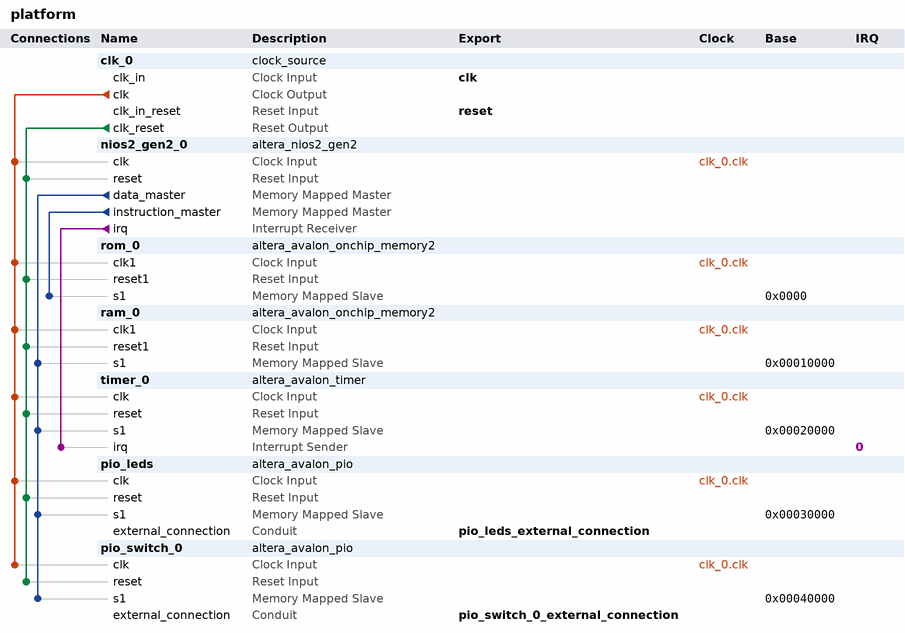
[diagram p0: system contents]
# Platform Designer (Qsys) system platform, Cyclone V 5CSEMA5F31C6
# Parameters at their usual value, and those the tool derives, are not listed.
package require -exact qsys 20.1
create_system platform
set_project_property DEVICE_FAMILY {Cyclone V}
set_project_property DEVICE 5CSEMA5F31C6

add_instance clk_0 clock_source 20.1
set_instance_parameter_value clk_0 clockFrequency 50000000

add_instance nios2_gen2_0 altera_nios2_gen2 20.1
set_instance_parameter_value nios2_gen2_0 dcache_size 2048
set_instance_parameter_value nios2_gen2_0 debug_enabled false
set_instance_parameter_value nios2_gen2_0 exceptionSlave rom_0.s1
set_instance_parameter_value nios2_gen2_0 icache_size 4096
set_instance_parameter_value nios2_gen2_0 impl Tiny
set_instance_parameter_value nios2_gen2_0 resetSlave rom_0.s1

add_instance rom_0 altera_avalon_onchip_memory2 20.1
set_instance_parameter_value rom_0 dataWidth 32
set_instance_parameter_value rom_0 dualPort false
set_instance_parameter_value rom_0 initMemContent true
set_instance_parameter_value rom_0 initializationFileName onchip_mem.hex
set_instance_parameter_value rom_0 memorySize 4096
set_instance_parameter_value rom_0 writable false

add_instance ram_0 altera_avalon_onchip_memory2 20.1
set_instance_parameter_value ram_0 dataWidth 32
set_instance_parameter_value ram_0 dualPort false
set_instance_parameter_value ram_0 initMemContent true
set_instance_parameter_value ram_0 initializationFileName onchip_mem.hex
set_instance_parameter_value ram_0 memorySize 16384

add_instance timer_0 altera_avalon_timer 20.1
set_instance_parameter_value timer_0 alwaysRun true
set_instance_parameter_value timer_0 fixedPeriod true
set_instance_parameter_value timer_0 period 1
set_instance_parameter_value timer_0 periodUnits SEC
set_instance_parameter_value timer_0 snapshot false

add_instance pio_leds altera_avalon_pio 20.1
set_instance_parameter_value pio_leds direction Output
set_instance_parameter_value pio_leds width 10

add_instance pio_switch_0 altera_avalon_pio 20.1
set_instance_parameter_value pio_switch_0 direction Input
set_instance_parameter_value pio_switch_0 width 1

# connections
add_connection clk_0.clk nios2_gen2_0.clk clock
add_connection clk_0.clk pio_leds.clk clock
add_connection clk_0.clk pio_switch_0.clk clock
add_connection clk_0.clk ram_0.clk1 clock
add_connection clk_0.clk rom_0.clk1 clock
add_connection clk_0.clk timer_0.clk clock
add_connection clk_0.clk_reset nios2_gen2_0.reset reset
add_connection clk_0.clk_reset pio_leds.reset reset
add_connection clk_0.clk_reset pio_switch_0.reset reset
add_connection clk_0.clk_reset ram_0.reset1 reset
add_connection clk_0.clk_reset rom_0.reset1 reset
add_connection clk_0.clk_reset timer_0.reset reset
add_connection nios2_gen2_0.data_master pio_leds.s1 avalon
set_connection_parameter_value nios2_gen2_0.data_master/pio_leds.s1 baseAddress 0x00030000
add_connection nios2_gen2_0.data_master pio_switch_0.s1 avalon
set_connection_parameter_value nios2_gen2_0.data_master/pio_switch_0.s1 baseAddress 0x00040000
add_connection nios2_gen2_0.data_master ram_0.s1 avalon
set_connection_parameter_value nios2_gen2_0.data_master/ram_0.s1 baseAddress 0x00010000
add_connection nios2_gen2_0.data_master timer_0.s1 avalon
set_connection_parameter_value nios2_gen2_0.data_master/timer_0.s1 baseAddress 0x00020000
add_connection nios2_gen2_0.instruction_master rom_0.s1 avalon
set_connection_parameter_value nios2_gen2_0.instruction_master/rom_0.s1 baseAddress 0x0000
add_connection nios2_gen2_0.irq timer_0.irq interrupt
set_connection_parameter_value nios2_gen2_0.irq/timer_0.irq irqNumber 0

# exported interfaces
add_interface clk clock sink
set_interface_property clk EXPORT_OF clk_0.clk_in
add_interface pio_leds_external_connection conduit end
set_interface_property pio_leds_external_connection EXPORT_OF pio_leds.external_connection
add_interface pio_switch_0_external_connection conduit end
set_interface_property pio_switch_0_external_connection EXPORT_OF pio_switch_0.external_connection
add_interface reset reset sink
set_interface_property reset EXPORT_OF clk_0.clk_in_reset

set_interconnect_requirement {$system} qsys_mm.clockCrossingAdapter HANDSHAKE
set_interconnect_requirement {$system} qsys_mm.enableEccProtection FALSE
set_interconnect_requirement {$system} qsys_mm.insertDefaultSlave FALSE
set_interconnect_requirement {$system} qsys_mm.maxAdditionalLatency 1

save_system platform.qsys
